# EAGLE schematic Placa_MTQ_Esq (EAGLE 9.7.0)
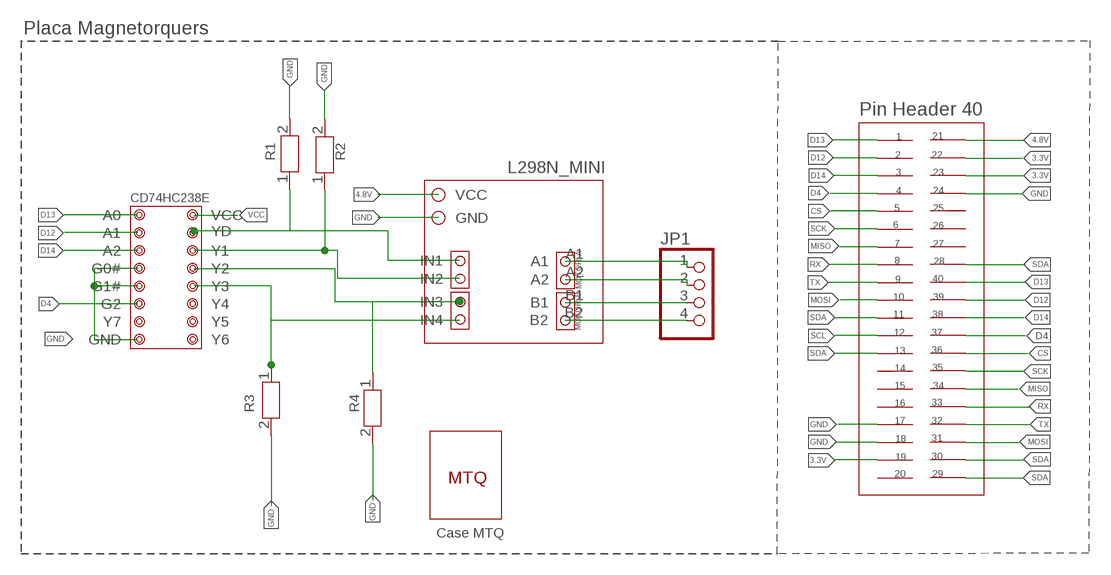
[diagram p0: schematic, sheet 1]

## Parts
JP1  PINHD-1X4  [1X04]
R1  RES_SMD  [RES_SMD]
R2  RES_SMD  [RES_SMD]
R3  RES_SMD  [RES_SMD]
R4  RES_SMD  [RES_SMD]
U$1  CD74HC238E  [CD74HC238E]
U$2  L298N_MINI  [L298N_MINI]
U$3  PINHEADER  [PINHEADER]
U$8  CASE_MTQ  [CASE_MTQ]

## Nets
3.3V: U$3.19 U$3.22 U$3.23
4.8V: U$2.VCC U$3.20 U$3.21
CS: U$3.5 U$3.36
D4: U$1.6(G2) U$3.4 U$3.37
D12: U$1.2(A1) U$3.2 U$3.39
D13: U$1.1(A0) U$3.1 U$3.40
D14: U$1.3(A2) U$3.3 U$3.38
GND: R1.2 R2.2 R3.2 R4.2 U$1.4(G0#) U$1.5(G1#) U$1.8(GND) U$2.GND U$3.17 U$3.18 U$3.24
MISO: U$3.7 U$3.34
MOSI: U$3.10 U$3.31
N$1: R1.1 U$1.15(YD) U$2.IN1
N$2: R4.1 U$1.13(Y2) U$2.IN3
N$3: R2.1 U$1.14(Y1) U$2.IN2
N$4: R3.1 U$1.12(Y3) U$2.IN4
N$6: JP1.1 U$2.A1
N$7: JP1.2 U$2.A2
N$8: JP1.3 U$2.B1
N$9: JP1.4 U$2.B2
RX: U$3.8 U$3.33
SCK: U$3.6 U$3.35
SCL: U$3.12
SDA: U$3.11 U$3.13 U$3.28 U$3.29 U$3.30
TX: U$3.9 U$3.32
VCC: U$1.16(VCC)
Unconnected: U$1.7(Y7) U$1.9(Y6) U$1.10(Y5) U$1.11(Y4) U$3.14 U$3.15 U$3.16 U$3.25 U$3.26 U$3.27

## Notes on the sheet
- Placa Magnetorquers
- Pin Header 40
- 1 | 21
- R1 | R2 | 2 | 22
- 3 | 23
- 4 | 24
- 5 | 25
- 6 | 26
- 7 | 27
- 8 | 28
- 9 | 40
- 10 | 39
- 11 | 38
- 12 | 37
- 13 | 36
- 14 | 35
- 15 | 34
- 16 | 33
- R3 | R4
- 17 | 32
- 18 | 31
- 19 | 30
- 20 | 29
- Case MTQ

## Library data of the parts
JP1 = Connector:PINHD-1X4: PIN HEADER; CATEGORY: Headers; DESCRIPTION: Header, Straight, 4 Position; MANUFACTURER: Generic; MPN: Generic; OPERATING_TEMPERATURE: Generic; PART_STATUS: Active; PITCH: 0.100" (2.54mm); ROHS_COMPLIANCE: Generic; SERIES: Generic; SUB-CATEGORY: Headers, Male Pins; TYPE: Board to Board or Cable, Unshrouded, Through Hole, Straight
R1-R4 = RES_SMD:RES_SMD
U$1 = CD74HC238E:CD74HC238E
U$2 = L298N_MINI:L298N_MINI
U$3 = PINHEADER-40:PINHEADER
U$8 = CASE_MTQ:CASE_MTQ

## Module WF
Ports: 

### Library data of the parts